# EAGLE schematic Utility Shield 1.2 (EAGLE 7.3.0)
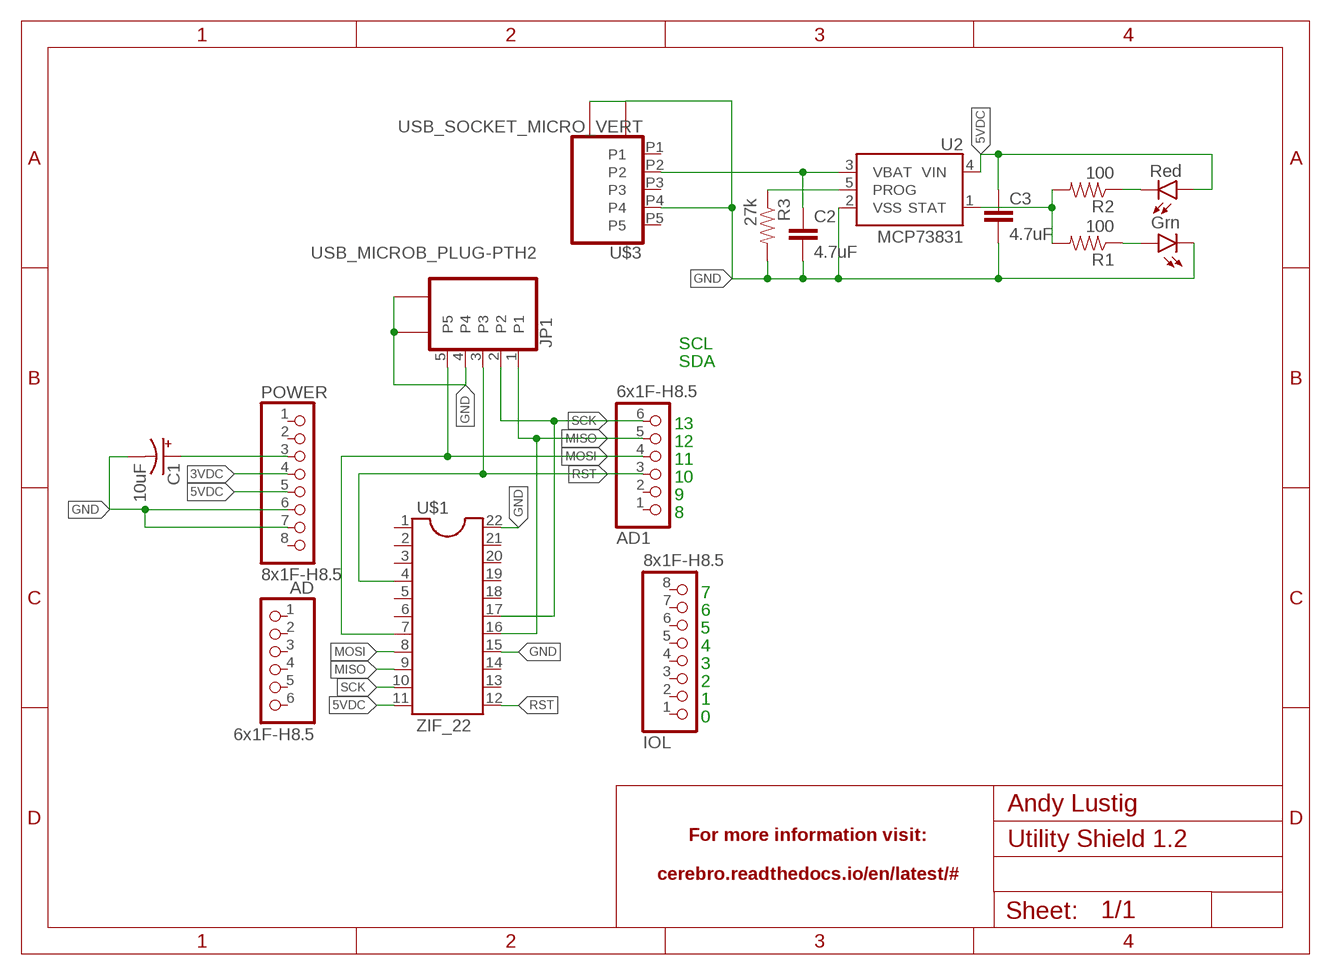
[diagram p0: schematic, sheet 1]

## Parts
AD  6x1F-H8.5  PINHD-1X6  [1X06]
AD1  6x1F-H8.5  PINHD-1X6  [1X06]
C1  10uF  CAP_POLPTH2  [CPOL-RADIAL-10UF-25V]
C2  4.7uF  1.0UF-25V-+80/-20(0805)  [0805]
C3  4.7uF  1.0UF-25V-+80/-20(0805)  [0805]
IOL  8x1F-H8.5  PINHD-1X8  [1X08]
JP1  USB_MICROB_PLUG-PTH2  [MICRO-B-TH]
POWER  8x1F-H8.5  PINHD-1X8  [1X08]
R1  100  RESISTOR0805-RES  [0805]
R2  100  RESISTOR0805-RES  [0805]
R3  27k  RESISTOR0805-RES  [0805]
U2  MCP73831  [SOT23-5]
U$1  ZIF_22  [ZIF_22]
U$2  LED_DUAL  [LED_DUAL]
U$3  USB_SOCKET_MICRO_VERT  [USB_VERT_MICRO_SMD]

## Nets
3VDC: POWER.4
5VDC: C3.1 POWER.5 U2.4(VIN) U$1.11 U$2.RA
GND: C1.2(-) C2.2 C3.2 JP1.4 JP1.P$1 JP1.P$2 POWER.6 POWER.7 R3.2 U2.2(VSS) U$1.15 U$1.22 U$2.GC U$3.P4 U$3.P$1 U$3.P$2 U$3.P$3
MISO: AD1.5 JP1.1 U$1.9 U$1.16
MOSI: AD1.4 JP1.5 U$1.7 U$1.8
N$1: C1.1(+) POWER.3
N$3: R1.2 R2.2 U2.1(STAT)
N$4: R1.1 U$2.GA
N$5: R2.1 U$2.RC
N$6: R3.1 U2.5(PROG)
N$9: C2.1 U2.3(VBAT) U$3.P2
RST: AD1.3 JP1.3 U$1.4 U$1.12
SCK: AD1.6 JP1.2 U$1.10 U$1.17
Unconnected: AD1.1 AD1.2 AD.1 AD.2 AD.3 AD.4 AD.5 AD.6 IOL.1 IOL.2 IOL.3 IOL.4 IOL.5 IOL.6 IOL.7 IOL.8 POWER.1 POWER.2 POWER.8 U$1.1 U$1.2 U$1.3 U$1.5 U$1.6 U$1.13 U$1.14 U$1.18 U$1.19 U$1.20 U$1.21 U$3.P1 U$3.P3 U$3.P5

## Notes on the sheet
- SCL
- SDA
- 13
- 12
- 11
- 10
- 9
- 8
- 7
- 6
- 5
- 4
- 3
- 2
- 1
- 0

## Library data of the parts
AD AD1 = SmartPrj:PINHD-1X6: PIN HEADER
C1 = SparkFun-Passives:CAP_POL: Capacitor Polarized These are standard SMD and PTH capacitors. Normally 10uF, 47uF, and 100uF in electrolytic and tantalum varieties. Always verify the external diameter of the through hole cap, it varies with capacity, voltage, and manufacturer. The EIA devices should be standard.
C2 C3 = SparkFun-Capacitors:1.0UF-25V-+80/-20(0805): CAP-11625; PROD_ID: CAP-11625; VALUE: 1.0uF
IOL POWER = SmartPrj:PINHD-1X8: PIN HEADER
JP1 = Andy-library:USB_MICROB_PLUG: USB Micro-B connectors Some male, some female. Watch your step!
R1-R3 = Andy-library:RESISTOR: Resistor Basic schematic elements and footprints for 0603, 1206, and PTH resistors.
U2 = SparkFun-PowerIC:MCP73831: Miniature single cell, fully integrated Li-Ion, Li-polymer charge management controller http://ww1.microchip.com/downloads/en/DeviceDoc/21984a.pdf IC-09995; PROD_ID: IC-09995
U$1 = Andy-library:ZIF_22
U$2 = Andy-library:LED_DUAL
U$3 = Andy-library:USB_SOCKET_MICRO_VERT: horizontal socket. Digikey 609-4616-1-ND

## Net classes
0 default: width 0.254 mm, clearance 0.254 mm
1 power: width 0.61 mm, drill 0.61 mm, clearance 0.254 mm
2 gnd: width 0.305 mm, drill 0.559 mm, clearance 0.254 mm
3 usbvcc: width 0.508 mm, drill 0.61 mm, clearance 0.254 mm
4 aref: width 0.406 mm, drill 0.61 mm, clearance 0.254 mm